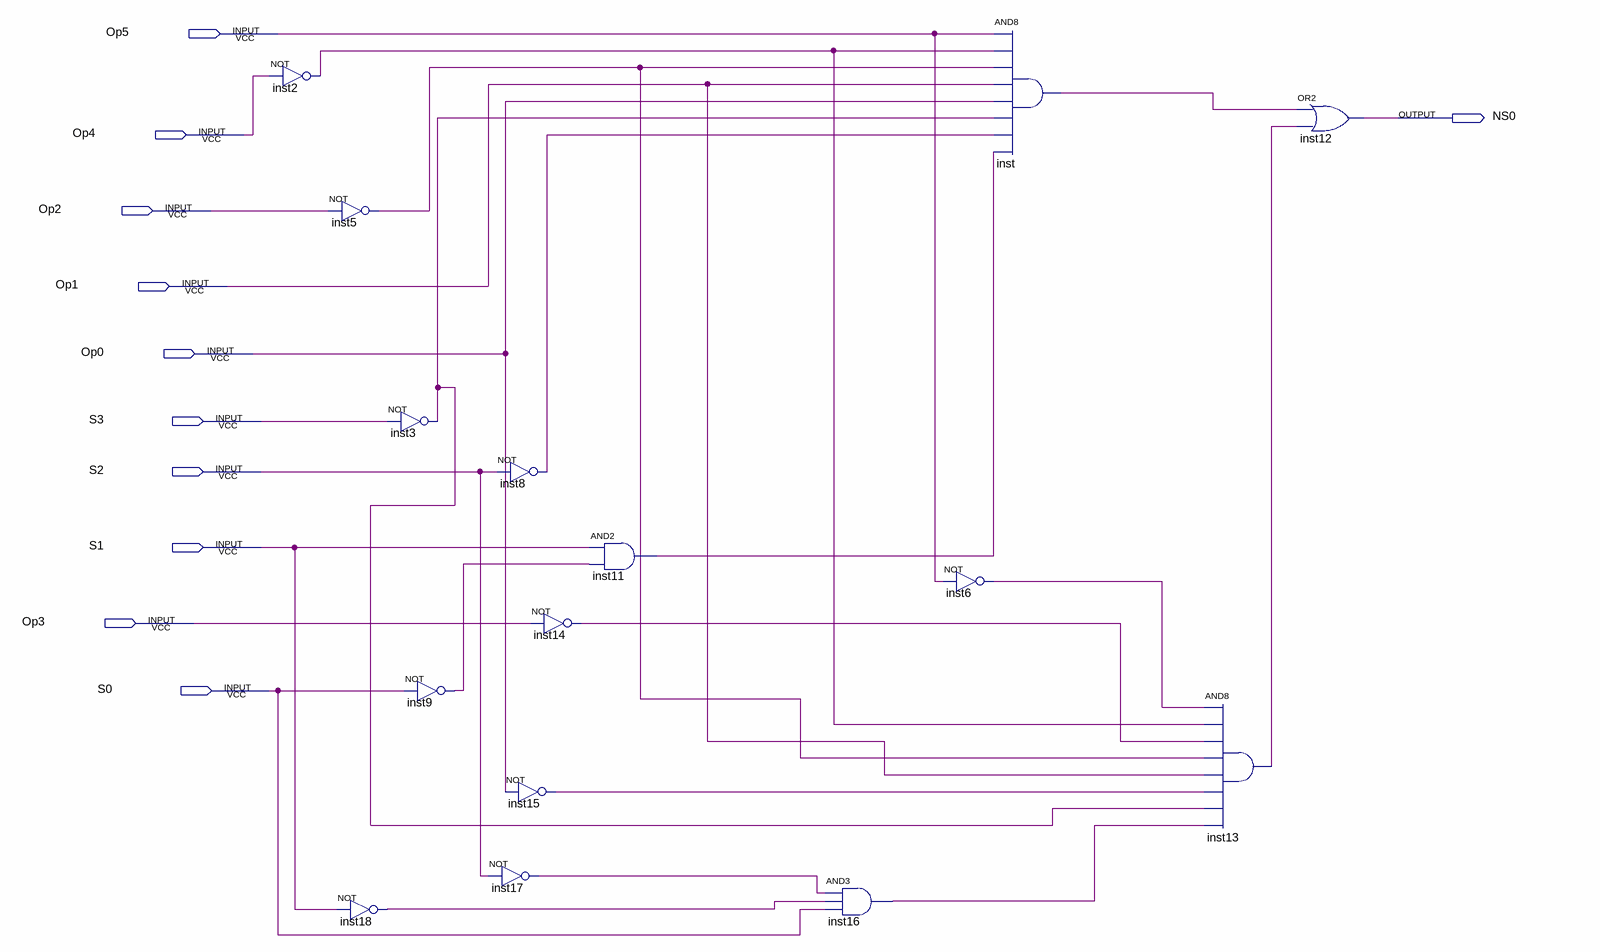
[diagram p0: schematic sheet]
// Quartus schematic NS0.bdf as structural Verilog: 15 symbols, 11 pins
module NS0 (
  input  Op5,
  input  Op4,
  input  Op2,
  input  Op1,
  input  Op0,
  input  S3,
  input  S2,
  input  S1,
  input  Op3,
  input  S0,
  output NS0
);

  wire inst2_out, inst3_out, inst5_out, inst6_out, inst8_out, inst9_out, inst11_out, inst13_out, inst14_out,
       inst15_out, inst16_out, inst17_out, inst18_out, inst_out;

  not inst2 (inst2_out, Op4);
  not inst5 (inst5_out, Op2);
  not inst18 (inst18_out, S1);
  not inst3 (inst3_out, S3);
  not inst9 (inst9_out, S0);
  not inst8 (inst8_out, S2);
  not inst17 (inst17_out, S2);
  not inst14 (inst14_out, Op3);
  not inst15 (inst15_out, Op0);
  and inst11 (inst11_out, S1, inst9_out);
  and inst16 (inst16_out, inst17_out, inst18_out, S0);
  not inst6 (inst6_out, Op5);
  and inst (inst_out, Op5, inst2_out, inst5_out, Op1, Op0, inst3_out, inst8_out, inst11_out);
  and inst13 (inst13_out, inst6_out, inst2_out, inst14_out, inst5_out, Op1, inst15_out, inst3_out, inst16_out);
  or inst12 (NS0, inst_out, inst13_out);
endmodule
